# EasyEDA Pro project Dispenser Motor Controller.eprj, board PCB1
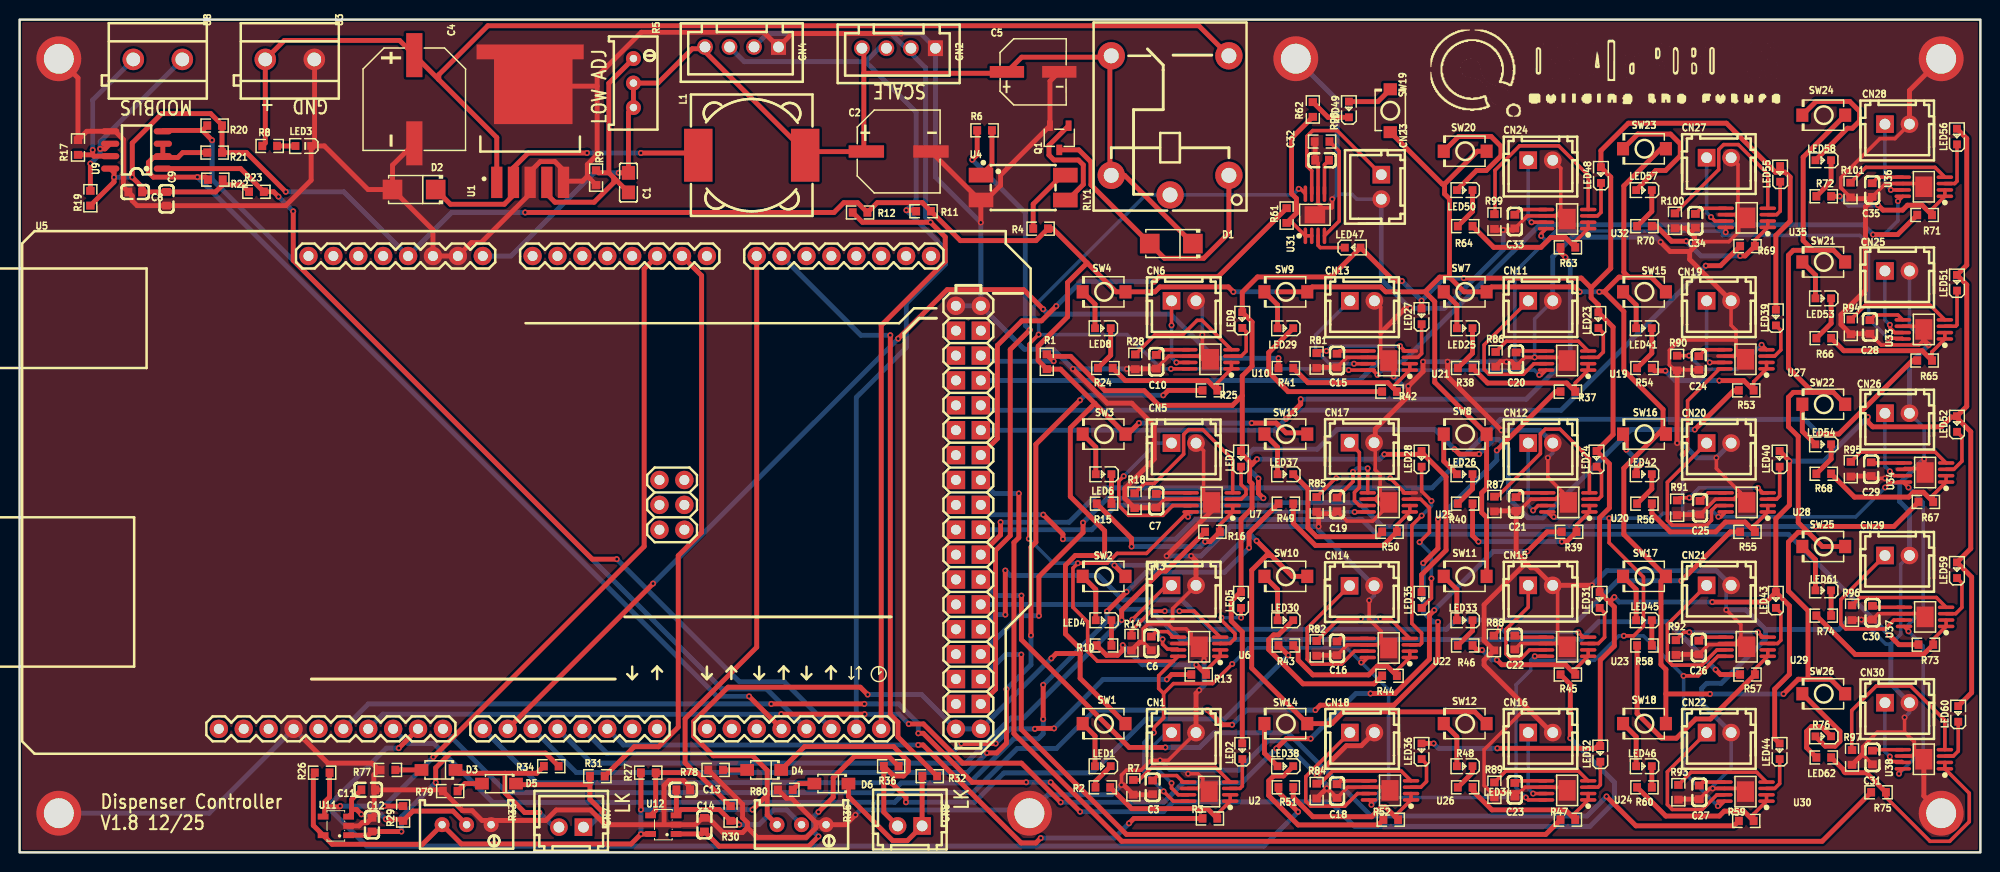
[diagram p3: board, top side]
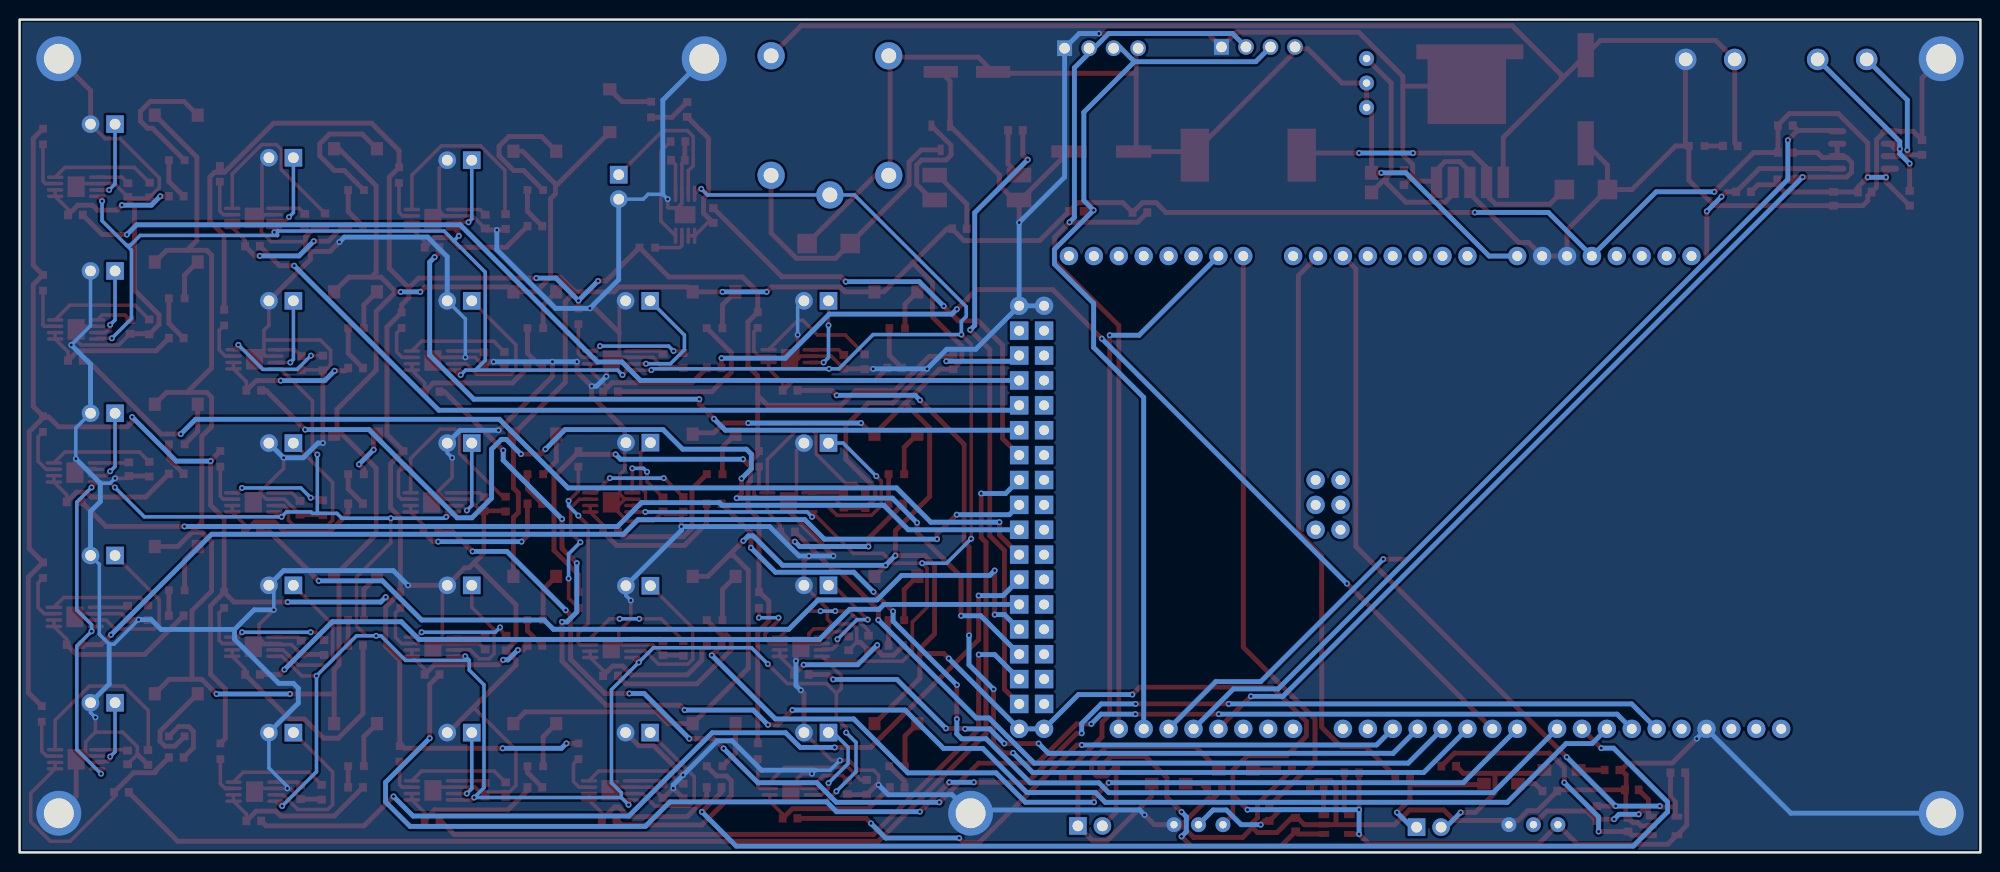
[diagram p4: board, bottom side, seen from below]

Outline 200 x 85 mm; copper layers: Top Layer, Bottom Layer. Coordinates in mm from the lower left corner of the outline.
Outline path: rectangle 0,85 200,0
Stack: Top Layer 0.035mm / Dielectric1 1.51mm FR4 er 4.5 / Bottom Layer 0.035mm

## Design rules (mm)
template: Custom Config
spacing copperThickness1oz (default): track to track 0.102, other pairs 0.152 to 0.3
spacing copperThickness2oz: track to track 0.203, other pairs 0.152 to 0.3
track width copperThickness1oz (default): min 0.127, default 0.5, max 2.54
track width copperThickness2oz: min 0.203, default 0.254, max 2.54
differential pair differentialPair (default): width min 0.127, default 0.254, max 2.54; gap min 0.152, default 0.152
via viaSize (default): diameter min 0.6, default 0.61, max 10; hole min 0.3, default 0.305, max 6.3

## Placement (name value [footprint] x y rotation side)
C1  5nF  [C0805]  62.1 68.36 90 top
C2  470uF  [CAP-SMD_BD8.0-L8.3-W8.3-LS9.1-FD]  89.66 71.54 0 top
C3  47uF  [C0603]  115.57 6.64 90 top
C4  220uF  [CAP-SMD_BD10.0-L10.3-W10.3-LS11.3-FD]  40.26 76.87 270 top
C5  220uF  [CAP-SMD_BD6.3-L6.6-W6.6-LS7.4-FD]  103.38 79.67 0 top
C6  47uF  [C0603]  115.43 21.33 90 top
C7  47uF  [C0603]  115.94 35.9 90 top
C8  10uF  [C0603]  11.79 67.4 180 top
C9  1uF  [C0603]  14.99 66.71 270 top
C10  47uF  [C0603]  115.94 50.08 90 top
C11  1uF  [C0603]  35.56 6.39 180 top
C12  1uF  [C0603]  35.94 2.83 270 top
C13  1uF  [C0603]  67.69 6.39 180 top
C14  1uF  [C0603]  69.85 2.83 270 top
C15  47uF  [C0603]  134.38 50.2 90 top
C16  47uF  [C0603]  134.38 20.83 90 top
C18  47uF  [C0603]  134.38 6.26 90 top
C19  47uF  [C0603]  134.38 35.52 90 top
C20  47uF  [C0603]  152.64 50.33 90 top
C21  47uF  [C0603]  152.64 35.56 90 top
C22  47uF  [C0603]  152.51 21.42 90 top
C23  47uF  [C0603]  152.51 6.39 90 top
C24  47uF  [C0603]  171.28 49.95 90 top
C25  47uF  [C0603]  171.4 35.18 90 top
C26  47uF  [C0603]  171.28 20.91 90 top
C27  47uF  [C0603]  171.33 6.13 90 top
C28  47uF  [C0603]  188.74 53.63 90 top
C29  47uF  [C0603]  188.86 39.11 90 top
C30  47uF  [C0603]  188.99 24.47 90 top
C31  47uF  [C0603]  188.99 9.69 90 top
C32  47uF  [C0603]  132.85 70.65 0 top
C33  47uF  [C0603]  152.51 64.39 90 top
C34  47uF  [C0603]  170.93 64.47 90 top
C35  47uF  [C0603]  188.96 67.6 90 top
CN1  ZX-XH2.54-2PZZ  [CONN-TH_2P-P2.50_HX25003-2A]  118.75 12.23 0 top
CN2  ZX-XH2.54-4PZZ  [CONN-TH_4P-P2.50_4PIN]  89.66 82.08 180 top
CN3  ZX-XH2.54-2PZZ  [CONN-TH_2P-P2.50_HX25003-2A]  118.75 27.26 0 top
CN4  ZX-XH2.54-4PZZ  [CONN-TH_4P-P2.50_4PIN]  73.66 82.21 180 top
CN5  ZX-XH2.54-2PZZ  [CONN-TH_2P-P2.50_HX25003-2A]  118.75 41.78 0 top
CN6  ZX-XH2.54-2PZZ  [CONN-TH_2P-P2.50_HX25003-2A]  118.75 56.3 0 top
CN7  ZX-XH2.54-2PZZ  [CONN-TH_2P-P2.50_HX25003-2A]  56.26 2.58 180 top
CN8  ZX-XH2.54-2PZZ  [CONN-TH_2P-P2.50_HX25003-2A]  90.81 2.7 180 top
CN11  ZX-XH2.54-2PZZ  [CONN-TH_2P-P2.50_HX25003-2A]  155.13 56.3 0 top
CN12  ZX-XH2.54-2PZZ  [CONN-TH_2P-P2.50_HX25003-2A]  155.13 41.78 0 top
CN13  ZX-XH2.54-2PZZ  [CONN-TH_2P-P2.50_HX25003-2A]  136.94 56.3 0 top
CN14  ZX-XH2.54-2PZZ  [CONN-TH_2P-P2.50_HX25003-2A]  136.91 27.22 0 top
CN15  ZX-XH2.54-2PZZ  [CONN-TH_2P-P2.50_HX25003-2A]  155.13 27.26 0 top
CN16  ZX-XH2.54-2PZZ  [CONN-TH_2P-P2.50_HX25003-2A]  155.13 12.23 0 top
CN17  ZX-XH2.54-2PZZ  [CONN-TH_2P-P2.50_HX25003-2A]  136.91 41.82 0 top
CN18  ZX-XH2.54-2PZZ  [CONN-TH_2P-P2.50_HX25003-2A]  136.94 12.23 0 top
CN19  ZX-XH2.54-2PZZ  [CONN-TH_2P-P2.50_HX25003-2A]  173.32 56.3 0 top
CN20  ZX-XH2.54-2PZZ  [CONN-TH_2P-P2.50_HX25003-2A]  173.32 41.78 0 top
CN21  ZX-XH2.54-2PZZ  [CONN-TH_2P-P2.50_HX25003-2A]  173.32 27.26 0 top
CN22  ZX-XH2.54-2PZZ  [CONN-TH_2P-P2.50_HX25003-2A]  173.32 12.23 0 top
CN23  ZX-XH2.54-2PZZ  [CONN-TH_2P-P2.50_HX25003-2A]  138.89 67.92 270 top
CN24  ZX-XH2.54-2PZZ  [CONN-TH_2P-P2.50_HX25003-2A]  155.13 70.65 0 top
CN25  ZX-XH2.54-2PZZ  [CONN-TH_2P-P2.50_HX25003-2A]  191.52 59.35 0 top
CN26  ZX-XH2.54-2PZZ  [CONN-TH_2P-P2.50_HX25003-2A]  191.52 44.83 0 top
CN27  ZX-XH2.54-2PZZ  [CONN-TH_2P-P2.50_HX25003-2A]  173.32 70.9 0 top
CN28  ZX-XH2.54-2PZZ  [CONN-TH_2P-P2.50_HX25003-2A]  191.52 74.33 0 top
CN29  ZX-XH2.54-2PZZ  [CONN-TH_2P-P2.50_HX25003-2A]  191.52 30.31 0 top
CN30  ZX-XH2.54-2PZZ  [CONN-TH_2P-P2.50_HX25003-2A]  191.52 15.28 0 top
D1  SS34  [SMA_L4.3-W2.6-LS5.2-RD]  117.47 62.14 180 top
D2  SS34  [SMA_L4.3-W2.6-LS5.2-RD]  40.24 67.66 180 top
D3  SMF5.0A  [SOD-123FL_L2.7-W1.8-LS3.8-RD]  42.73 8.42 180 top
D4  SMF5.0A  [SOD-123FL_L2.7-W1.8-LS3.8-RD]  75.95 8.42 180 top
D5  SMF5.0A  [SOD-123FL_L2.7-W1.8-LS3.8-RD]  48.89 7.02 180 top
D6  SMF5.0A  [SOD-123FL_L2.7-W1.8-LS3.8-RD]  82.8 7.02 180 top
L1  33uH  [IND-SMD_L12.3-W12.3]  74.68 71.16 0 top
LED1  XL-1608SURC-06  [LED0603-RD_RED]  110.49 8.8 180 top
LED2  XL-1608SURC-06  [LED0603-RD_RED]  124.71 10.32 90 top
LED3  XL-1608UGC-04  [LED0603-RD_GREEN]  28.94 72.1 180 top
LED4  XL-1608SURC-06  [LED0603-RD_RED]  110.57 23.7 180 top
LED5  XL-1608SURC-06  [LED0603-RD_RED]  124.59 25.75 90 top
LED6  XL-1608SURC-06  [LED0603-RD_RED]  110.57 38.6 180 top
LED7  XL-1608SURC-06  [LED0603-RD_RED]  124.59 40.17 90 top
LED8  XL-1608SURC-06  [LED0603-RD_RED]  110.49 53.5 180 top
LED9  XL-1608SURC-06  [LED0603-RD_RED]  124.71 54.33 90 top
LED23  XL-1608SURC-06  [LED0603-RD_RED]  161.04 54.32 90 top
LED24  XL-1608SURC-06  [LED0603-RD_RED]  160.85 40.17 90 top
LED25  XL-1608SURC-06  [LED0603-RD_RED]  147.4 53.5 180 top
LED26  XL-1608SURC-06  [LED0603-RD_RED]  147.4 38.6 180 top
LED27  XL-1608SURC-06  [LED0603-RD_RED]  143 54.71 90 top
LED28  XL-1608SURC-06  [LED0603-RD_RED]  143 40.17 90 top
LED29  XL-1608SURC-06  [LED0603-RD_RED]  129.11 53.5 180 top
LED30  XL-1608SURC-06  [LED0603-RD_RED]  129.11 23.7 180 top
LED31  XL-1608SURC-06  [LED0603-RD_RED]  161.16 25.75 90 top
LED32  XL-1608SURC-06  [LED0603-RD_RED]  161.23 10.06 90 top
LED33  XL-1608SURC-06  [LED0603-RD_RED]  147.4 23.7 180 top
LED34  XL-1608SURC-06  [LED0603-RD_RED]  147.4 8.8 180 top
LED35  XL-1608SURC-06  [LED0603-RD_RED]  143 25.75 90 top
LED36  XL-1608SURC-06  [LED0603-RD_RED]  143 10.32 90 top
LED37  XL-1608SURC-06  [LED0603-RD_RED]  129.11 38.6 180 top
LED38  XL-1608SURC-06  [LED0603-RD_RED]  129.11 8.8 180 top
LED39  XL-1608SURC-06  [LED0603-RD_RED]  179.14 54.58 90 top
LED40  XL-1608SURC-06  [LED0603-RD_RED]  179.52 40.17 90 top
LED41  XL-1608SURC-06  [LED0603-RD_RED]  165.69 53.5 180 top
LED42  XL-1608SURC-06  [LED0603-RD_RED]  165.69 38.6 180 top
LED43  XL-1608SURC-06  [LED0603-RD_RED]  179.14 25.75 90 top
LED44  XL-1608SURC-06  [LED0603-RD_RED]  179.52 10.32 90 top
LED45  XL-1608SURC-06  [LED0603-RD_RED]  165.69 23.7 180 top
LED46  XL-1608SURC-06  [LED0603-RD_RED]  165.69 8.8 180 top
LED47  XL-1608SURC-06  [LED0603-RD_RED]  135.97 61.73 0 top
LED48  XL-1608SURC-06  [LED0603-RD_RED]  161.3 69.12 90 top
LED49  XL-1608SURC-06  [LED0603-RD_RED]  135.59 75.83 90 top
LED50  XL-1608SURC-06  [LED0603-RD_RED]  147.4 67.6 180 top
LED51  XL-1608SURC-06  [LED0603-RD_RED]  197.61 58.14 90 top
LED52  XL-1608SURC-06  [LED0603-RD_RED]  197.61 43.72 90 top
LED53  XL-1608SURC-06  [LED0603-RD_RED]  183.97 56.55 180 top
LED54  XL-1608SURC-06  [LED0603-RD_RED]  183.97 41.65 180 top
LED55  XL-1608SURC-06  [LED0603-RD_RED]  179.58 69.25 90 top
LED56  XL-1608SURC-06  [LED0603-RD_RED]  197.61 73.06 90 top
LED57  XL-1608SURC-06  [LED0603-RD_RED]  165.69 67.6 180 top
LED58  XL-1608SURC-06  [LED0603-RD_RED]  183.97 70.65 180 top
LED59  XL-1608SURC-06  [LED0603-RD_RED]  197.61 28.8 90 top
LED60  XL-1608SURC-06  [LED0603-RD_RED]  197.74 14.13 90 top
LED61  XL-1608SURC-06  [LED0603-RD_RED]  183.97 26.75 180 top
LED62  XL-1608SURC-06  [LED0603-RD_RED]  183.97 11.85 180 top
NOREF  -  [Pad_e268864]  103 4 0 top
NOREF#2  -  [Pad_e268862]  196 4 0 top
NOREF#3  -  [Pad_e268861]  196 81 0 top
NOREF#4  -  [Pad_e268863]  130.17 81.01 0 top
NOREF#5  -  [Pad_e268859]  4 4 0 top
NOREF#6  -  [Pad_e268860]  4 81 0 top
Q1  S8050  [SOT-23-3_L2.9-W1.6-P1.90-LS2.8-BR]  106.04 72.94 90 top
R1  10kΩ  [R0603]  104.78 50.08 270 top
R2  1kΩ  [R0603]  110.49 6.64 0 top
R3  4.7kΩ  [R0603]  121.41 3.47 180 top
R4  1kΩ  [R0603]  104.14 63.66 0 top
R5  10kΩ  [RES-ADJ-TH_3P-L10.0-W10.0-P2.50-L]  62.61 78.52 270 top
R6  1kΩ  [R0603]  98.43 73.7 180 top
R7  1kΩ  [R0603]  113.6 6.64 270 top
R8  4.7kΩ  [R0603]  25.51 72.1 0 top
R9  1.15kΩ  [R0603]  58.8 68.87 90 top
R10  1kΩ  [R0603]  110.62 21.12 180 top
R11  4.7kΩ  [R0603]  92.2 65.44 180 top
R12  4.7kΩ  [R0603]  85.72 65.31 180 top
R13  4.7kΩ  [R0603]  120.27 18.16 180 top
R14  1kΩ  [R0603]  113.41 21.37 270 top
R15  1kΩ  [R0603]  110.62 35.6 180 top
R16  4.7kΩ  [R0603]  121.67 32.72 180 top
R17  20kΩ  [R0603]  5.96 71.95 270 top
R18  1kΩ  [R0603]  113.73 35.9 270 top
R19  20kΩ  [R0603]  7.22 66.77 90 top
R20  10kΩ  [R0603]  19.89 74.19 180 top
R21  10kΩ  [R0603]  19.89 71.43 180 top
R22  10kΩ  [R0603]  19.96 68.67 180 top
R23  10kΩ  [R0603]  24.16 67.43 0 top
R24  1kΩ  [R0603]  110.74 49.44 0 top
R25  4.7kΩ  [R0603]  121.41 47.15 180 top
R26  10kΩ  [R0603]  30.86 8.14 180 top
R27  10kΩ  [R0603]  64.13 8.14 180 top
R28  1kΩ  [R0603]  113.8 50.08 270 top
R29  1MΩ  [R0603]  39.12 3.97 90 top
R30  1MΩ  [R0603]  72.52 3.97 90 top
R31  100kΩ  [R0603]  58.93 7.78 180 top
R32  100kΩ  [R0603]  92.84 7.78 180 top
R33  10kΩ  [RES-ADJ-TH_3P-L10.0-W10.0-P2.50-L]  45.59 2.83 180 top
R34  100kΩ  [R0603]  54.23 8.8 0 top
R35  10kΩ  [RES-ADJ-TH_3P-L10.0-W10.0-P2.50-L]  79.76 2.83 180 top
R36  100kΩ  [R0603]  88.9 8.8 0 top
R37  4.7kΩ  [R0603]  157.92 47.03 180 top
R38  1kΩ  [R0603]  147.45 49.44 0 top
R39  4.7kΩ  [R0603]  158.05 32.72 180 top
R40  1kΩ  [R0603]  147.45 35.6 0 top
R41  4.7kΩ  [R0603]  129.16 49.44 180 top
R42  1kΩ  [R0603]  139.73 47.03 0 top
R43  4.7kΩ  [R0603]  129.16 21.12 180 top
R44  1kΩ  [R0603]  139.73 18.03 0 top
R45  4.7kΩ  [R0603]  157.92 18.16 180 top
R46  1kΩ  [R0603]  147.45 21.12 0 top
R47  4.7kΩ  [R0603]  157.92 3.34 180 top
R48  1kΩ  [R0603]  147.45 6.64 0 top
R49  4.7kΩ  [R0603]  129.16 35.6 180 top
R50  1kΩ  [R0603]  139.73 32.72 0 top
R51  4.7kΩ  [R0603]  129.16 6.64 180 top
R52  1kΩ  [R0603]  139.86 3.34 0 top
R53  4.7kΩ  [R0603]  176.12 47.15 180 top
R54  1kΩ  [R0603]  165.74 49.44 0 top
R55  4.7kΩ  [R0603]  176.24 32.72 180 top
R56  1kΩ  [R0603]  165.74 35.6 0 top
R57  4.7kΩ  [R0603]  176.24 18.16 180 top
R58  1kΩ  [R0603]  165.74 21.12 180 top
R59  4.7kΩ  [R0603]  176.12 3.21 180 top
R60  1kΩ  [R0603]  165.74 6.64 180 top
R61  4.7kΩ  [R0603]  129.24 65 90 top
R62  1kΩ  [R0603]  131.91 75.83 270 top
R63  4.7kΩ  [R0603]  157.92 61.76 180 top
R64  1kΩ  [R0603]  147.45 63.92 0 top
R65  4.7kΩ  [R0603]  194.31 50.2 180 top
R66  1kΩ  [R0603]  184.02 52.49 0 top
R67  4.7kΩ  [R0603]  194.44 35.77 180 top
R68  1kΩ  [R0603]  184.02 38.64 0 top
R69  4.7kΩ  [R0603]  176.24 61.88 180 top
R70  1kΩ  [R0603]  165.74 63.92 0 top
R71  4.7kΩ  [R0603]  194.31 65.06 180 top
R72  1kΩ  [R0603]  184.02 66.97 0 top
R73  4.7kΩ  [R0603]  194.44 21.2 180 top
R74  1kΩ  [R0603]  184.02 24.17 180 top
R75  4.7kΩ  [R0603]  189.61 6.13 180 top
R76  1kΩ  [R0603]  184.02 9.69 0 top
R77  1kΩ  [R0603]  37.57 8.42 180 top
R78  1kΩ  [R0603]  70.99 8.42 180 top
R79  1kΩ  [R0603]  43.92 6.26 180 top
R80  1kΩ  [R0603]  78.1 6.39 180 top
R81  1kΩ  [R0603]  132.3 50.2 270 top
R82  1kΩ  [R0603]  132.3 20.83 270 top
R84  1kΩ  [R0603]  132.3 6.26 270 top
R85  1kΩ  [R0603]  132.3 35.52 270 top
R86  1kΩ  [R0603]  150.56 50.33 270 top
R87  1kΩ  [R0603]  150.43 35.56 270 top
R88  1kΩ  [R0603]  150.38 21.37 270 top
R89  1kΩ  [R0603]  150.43 6.39 270 top
R90  1kΩ  [R0603]  169.07 49.95 270 top
R91  1kΩ  [R0603]  169.07 35.18 270 top
R92  1kΩ  [R0603]  168.94 20.91 270 top
R93  1kΩ  [R0603]  169.2 6.14 270 top
R94  1kΩ  [R0603]  186.78 53.63 270 top
R95  1kΩ  [R0603]  186.78 39.11 270 top
R96  1kΩ  [R0603]  186.91 24.47 270 top
R97  1kΩ  [R0603]  186.91 9.69 270 top
R98  1kΩ  [R0603]  132.85 72.55 180 top
R99  1kΩ  [R0603]  150.43 64.39 270 top
R100  1kΩ  [R0603]  168.85 64.47 270 top
R101  1kΩ  [R0603]  186.75 67.6 270 top
RLY1  SRD-05VDC-SL-C  [RELAY-TH_SRD-XXVDC-XL-C]  117.35 74.2 90 top
SW1  TS-1088-AR02016  [SW-SMD_L3.9-W3.0-P4.45]  110.62 13.14 180 top
SW2  TS-1088-AR02016  [SW-SMD_L3.9-W3.0-P4.45]  110.62 28.17 180 top
SW3  TS-1088-AR02016  [SW-SMD_L3.9-W3.0-P4.45]  110.62 42.69 180 top
SW4  TS-1088-AR02016  [SW-SMD_L3.9-W3.0-P4.45]  110.62 57.21 180 top
SW7  TS-1088-AR02016  [SW-SMD_L3.9-W3.0-P4.45]  147.45 57.21 180 top
SW8  TS-1088-AR02016  [SW-SMD_L3.9-W3.0-P4.45]  147.45 42.69 180 top
SW9  TS-1088-AR02016  [SW-SMD_L3.9-W3.0-P4.45]  129.16 57.21 180 top
SW10  TS-1088-AR02016  [SW-SMD_L3.9-W3.0-P4.45]  129.16 28.17 180 top
SW11  TS-1088-AR02016  [SW-SMD_L3.9-W3.0-P4.45]  147.45 28.17 180 top
SW12  TS-1088-AR02016  [SW-SMD_L3.9-W3.0-P4.45]  147.45 13.14 180 top
SW13  TS-1088-AR02016  [SW-SMD_L3.9-W3.0-P4.45]  129.16 42.69 180 top
SW14  TS-1088-AR02016  [SW-SMD_L3.9-W3.0-P4.45]  129.16 13.14 180 top
SW15  TS-1088-AR02016  [SW-SMD_L3.9-W3.0-P4.45]  165.74 57.21 180 top
SW16  TS-1088-AR02016  [SW-SMD_L3.9-W3.0-P4.45]  165.74 42.69 180 top
SW17  TS-1088-AR02016  [SW-SMD_L3.9-W3.0-P4.45]  165.74 28.17 180 top
SW18  TS-1088-AR02016  [SW-SMD_L3.9-W3.0-P4.45]  165.74 13.14 180 top
SW19  TS-1088-AR02016  [SW-SMD_L3.9-W3.0-P4.45]  139.81 75.7 90 top
SW20  TS-1088-AR02016  [SW-SMD_L3.9-W3.0-P4.45]  147.45 71.56 180 top
SW21  TS-1088-AR02016  [SW-SMD_L3.9-W3.0-P4.45]  184.02 60.26 180 top
SW22  TS-1088-AR02016  [SW-SMD_L3.9-W3.0-P4.45]  184.02 45.74 180 top
SW23  TS-1088-AR02016  [SW-SMD_L3.9-W3.0-P4.45]  165.74 71.82 180 top
SW24  TS-1088-AR02016  [SW-SMD_L3.9-W3.0-P4.45]  184.02 75.25 180 top
SW25  TS-1088-AR02016  [SW-SMD_L3.9-W3.0-P4.45]  184.02 31.22 180 top
SW26  TS-1088-AR02016  [SW-SMD_L3.9-W3.0-P4.45]  184.02 16.19 180 top
U1  LM2596SX-ADJ/NOPB  [TO-263-5_L10.2-W8.9-P1.70-TL]  52.07 73.39 90 top
U2  TPS1H200AQDGNRQ1  [EMSOP-8_L3.0-W3.0-P0.65-LS4.9-BL-EP-A]  121.33 6.2 90 top
U3  KF301-5.0-2P  [CONN-TH_P5.00_KF301-5.0-2P]  27.56 80.94 180 top
U4  PC817C  [OPTO-SMD-4_L4.6-W6.5-P2.54-LS10.3-TL]  102.36 67.86 0 top
U5  Arduino Mega 2560  [ARDUINO MEGA 2560 ADDON ON PCB]  5.33 10.07 0 top
U6  TPS1H200AQDGNRQ1  [EMSOP-8_L3.0-W3.0-P0.65-LS4.9-BL-EP-A]  120.32 20.99 90 top
U7  TPS1H200AQDGNRQ1  [EMSOP-8_L3.0-W3.0-P0.65-LS4.9-BL-EP-A]  121.59 35.72 90 top
U8  KF301-5.0-2P  [CONN-TH_P5.00_KF301-5.0-2P]  14.1 80.94 180 top
U9  MAX485ED  [SOP-8_L4.9-W3.9-P1.27-LS6.0-BL]  11.92 71.7 90 top
U10  TPS1H200AQDGNRQ1  [EMSOP-8_L3.0-W3.0-P0.65-LS4.9-BL-EP-A]  121.46 50.33 90 top
U11  LMV331IDBVR  [SOT-23-5_L3.0-W1.7-P0.95-LS2.8-BR]  32.26 2.7 0 top
U12  LMV331IDBVR  [SOT-23-5_L3.0-W1.7-P0.95-LS2.8-BR]  65.66 2.83 0 top
U19  TPS1H200AQDGNRQ1  [EMSOP-8_L3.0-W3.0-P0.65-LS4.9-BL-EP-A]  157.85 50.2 90 top
U20  TPS1H200AQDGNRQ1  [EMSOP-8_L3.0-W3.0-P0.65-LS4.9-BL-EP-A]  157.97 35.72 90 top
U21  TPS1H200AQDGNRQ1  [EMSOP-8_L3.0-W3.0-P0.65-LS4.9-BL-EP-A]  139.65 50.2 90 top
U22  TPS1H200AQDGNRQ1  [EMSOP-8_L3.0-W3.0-P0.65-LS4.9-BL-EP-A]  139.65 20.86 90 top
U23  TPS1H200AQDGNRQ1  [EMSOP-8_L3.0-W3.0-P0.65-LS4.9-BL-EP-A]  157.85 20.99 90 top
U24  TPS1H200AQDGNRQ1  [EMSOP-8_L3.0-W3.0-P0.65-LS4.9-BL-EP-A]  157.85 6.33 90 top
U25  TPS1H200AQDGNRQ1  [EMSOP-8_L3.0-W3.0-P0.65-LS4.9-BL-EP-A]  139.65 35.72 90 top
U26  TPS1H200AQDGNRQ1  [EMSOP-8_L3.0-W3.0-P0.65-LS4.9-BL-EP-A]  139.78 6.33 90 top
U27  TPS1H200AQDGNRQ1  [EMSOP-8_L3.0-W3.0-P0.65-LS4.9-BL-EP-A]  176.04 50.33 90 top
U28  TPS1H200AQDGNRQ1  [EMSOP-8_L3.0-W3.0-P0.65-LS4.9-BL-EP-A]  176.16 35.72 90 top
U29  TPS1H200AQDGNRQ1  [EMSOP-8_L3.0-W3.0-P0.65-LS4.9-BL-EP-A]  176.16 20.99 90 top
U30  TPS1H200AQDGNRQ1  [EMSOP-8_L3.0-W3.0-P0.65-LS4.9-BL-EP-A]  176.04 6.2 90 top
U31  TPS1H200AQDGNRQ1  [EMSOP-8_L3.0-W3.0-P0.65-LS4.9-BL-EP-A]  132.12 65.08 0 top
U32  TPS1H200AQDGNRQ1  [EMSOP-8_L3.0-W3.0-P0.65-LS4.9-BL-EP-A]  157.85 64.64 90 top
U33  TPS1H200AQDGNRQ1  [EMSOP-8_L3.0-W3.0-P0.65-LS4.9-BL-EP-A]  194.23 53.38 90 top
U34  TPS1H200AQDGNRQ1  [EMSOP-8_L3.0-W3.0-P0.65-LS4.9-BL-EP-A]  194.36 38.77 90 top
U35  TPS1H200AQDGNRQ1  [EMSOP-8_L3.0-W3.0-P0.65-LS4.9-BL-EP-A]  176.16 64.77 90 top
U36  TPS1H200AQDGNRQ1  [EMSOP-8_L3.0-W3.0-P0.65-LS4.9-BL-EP-A]  194.23 67.94 90 top
U37  TPS1H200AQDGNRQ1  [EMSOP-8_L3.0-W3.0-P0.65-LS4.9-BL-EP-A]  194.36 24.04 90 top
U38  TPS1H200AQDGNRQ1  [EMSOP-8_L3.0-W3.0-P0.65-LS4.9-BL-EP-A]  194.23 9.51 90 top

## Footprints (pads in the part's own frame, mm; a bottom-side part is the same pattern mirrored in y, then rotated)
ARDUINO MEGA 2560 ADDON ON PCB
  round 1.879 hole 1.016: 0(59.69,2.54) 1(57.15,2.54) 2(54.61,2.54) 3(52.07,2.54) 3.3V(31.75,50.8) 4(49.53,2.54) 5(46.99,2.54) 5V@0(34.29,50.8) 5V@1(90.17,2.54) 5V@2(92.71,2.54) 6(44.45,2.54) 7(41.91,2.54) 8(37.846,2.54) 9(35.306,2.54) 10(32.766,2.54) 11(30.226,2.54) 12(27.686,2.54) 13(25.146,2.54) 14(64.77,2.54) 15(67.31,2.54) 16(69.85,2.54) 17(72.39,2.54) 18(74.93,2.54) 19(77.47,2.54) 20(80.01,2.54) 21(82.55,2.54) A0(46.99,50.8) A1(49.53,50.8) A2(52.07,50.8) A3(54.61,50.8) A4(57.15,50.8) A5(59.69,50.8) A6(62.23,50.8) A7(64.77,50.8) A8(69.85,50.8) A9(72.39,50.8) A10(74.93,50.8) A11(77.47,50.8) A12(80.01,50.8) A13(82.55,50.8) A14(85.09,50.8) A15(87.63,50.8) AREF(20.066,2.54) GND@0(36.83,50.8) GND@1(39.37,50.8) GND@2(22.606,2.54) GND@3(90.17,45.72) GND@4(92.71,45.72) IOREF(26.67,50.8) ISP1_1(59.933,22.86) ISP1_2(62.473,22.86) ISP1_3(59.933,25.4) ISP1_4(62.473,25.4) ISP1_5(59.933,27.94) ISP1_6(62.473,27.94) NC@0(14.986,2.54) NC@1(17.526,2.54) NC@2(24.13,50.8) RESET(29.21,50.8) VIN(41.91,50.8)
  rect 1.879x1.879 hole 1.016: 22(90.17,5.08) 23(92.71,5.08) 24(90.17,7.62) 25(92.71,7.62) 26(90.17,10.16) 27(92.71,10.16) 28(90.17,12.7) 29(92.71,12.7) 30(90.17,15.24) 31(92.71,15.24) 32(90.17,17.78) 33(92.71,17.78) 34(90.17,20.32) 35(92.71,20.32) 36(90.17,22.86) 37(92.71,22.86) 38(90.17,25.4) 39(92.71,25.4) 40(90.17,27.94) 41(92.71,27.94) 42(90.17,30.48) 43(92.71,30.48) 44(90.17,33.02) 45(92.71,33.02) 46(90.17,35.56) 47(92.71,35.56) 48(90.17,38.1) 49(92.71,38.1) 50(90.17,40.64) 51(92.71,40.64) 52(90.17,43.18) 53(92.71,43.18)
C0603
  rect 0.8x0.9 smd: 1(-0.7,0) 2(0.7,0)
C0805
  rect 1.41x1.35 smd: 1(-1,0) 2(1,0)
CAP-SMD_BD6.3-L6.6-W6.6-LS7.4-FD
  rect 3.5x1.2 smd: 1(-2.67,0) 2(2.67,0)
CAP-SMD_BD8.0-L8.3-W8.3-LS9.1-FD
  rect 3.61x1.26 smd: 1(-3.295,0) 2(3.295,0)
CAP-SMD_BD10.0-L10.3-W10.3-LS11.3-FD
  rect 4.5x1.65 smd: 1(-4.5,0) 2(4.5,0)
CONN-TH_2P-P2.50_HX25003-2A
  rect 1.8x1.8 hole 1.1: 1(-1.25,0)
  round 1.8 hole 1.1: 2(1.25,0)
CONN-TH_4P-P2.50_4PIN
  rect 1.524x1.6 hole 1.1: 1(-3.75,0)
  round 1.6 hole 1.1: 2(-1.25,0) 3(1.25,0) 4(3.75,0)
CONN-TH_P5.00_KF301-5.0-2P
  round 2.2 hole 1.4: 1(-2.5,0) 2(2.5,0)
EMSOP-8_L3.0-W3.0-P0.65-LS4.9-BL-EP-A
  oval 0.364x1.692 smd: 1(-0.975,-2.146) 2(-0.325,-2.146) 3(0.325,-2.146) 4(0.975,-2.146) 5(0.975,2.146) 6(0.325,2.146) 7(-0.325,2.146) 8(-0.975,2.146)
  rect 2.1x1.75 smd: 9(0,0)
IND-SMD_L12.3-W12.3
  rect 2.9x5.4 smd: 1(-5.45,0) 2(5.45,0)
LED0603-RD_GREEN
  rect 0.8x0.8 smd: 1(-0.799,-0.004) 2(0.799,0.004)
LED0603-RD_RED
  rect 0.8x0.8 smd: 1(-0.799,-0.004) 2(0.799,0.004)
OPTO-SMD-4_L4.6-W6.5-P2.54-LS10.3-TL
  rect 2.5x1.5 smd: 1(-4.3,1.27) 2(-4.3,-1.27) 3(4.3,-1.27) 4(4.3,1.27)
Pad_e268859
  round 4.572 hole 3.048: 1(0,0)
Pad_e268860
  round 4.572 hole 3.048: 1(0,0)
Pad_e268861
  round 4.572 hole 3.048: 1(0,0)
Pad_e268862
  round 4.572 hole 3.048: 1(0,0)
Pad_e268863
  round 4.572 hole 3.048: 1(0,0)
Pad_e268864
  round 4.572 hole 3.048: 1(0,0)
R0603
  rect 0.806x0.864 smd: 1(-0.753,0) 2(0.753,0)
RELAY-TH_SRD-XXVDC-XL-C
  round 2.794 hole 1.524: 1(-5.1,-6) 2(7.1,-6) 3(7.1,6) 4(-5.1,6) 5(-7.1,0)
RES-ADJ-TH_3P-L10.0-W10.0-P2.50-L
  round 1.524 hole 0.762: 1(-2.5,0) 2(0,0) 3(2.5,0)
SMA_L4.3-W2.6-LS5.2-RD
  rect 2x2 smd: 1(-2.2,0) 2(2.2,0)
SOD-123FL_L2.7-W1.8-LS3.8-RD
  rect 1.4x1.2 smd: 1(-1.735,0) 2(1.735,0)
SOP-8_L4.9-W3.9-P1.27-LS6.0-BL
  oval 0.63x1.865 smd: 1(-1.905,-2.683) 2(-0.635,-2.683) 3(0.635,-2.683) 4(1.905,-2.683) 5(1.905,2.683) 6(0.635,2.683) 7(-0.635,2.683) 8(-1.905,2.683)
SOT-23-3_L2.9-W1.6-P1.90-LS2.8-BR
  rect 1.07x0.6 smd: 1(1.235,-0.95) 2(1.235,0.95) 3(-1.235,0)
SOT-23-5_L3.0-W1.7-P0.95-LS2.8-BR
  rect 1.1x0.6 smd: 1(1.3,-0.95) 2(1.3,0) 3(1.3,0.95) 4(-1.3,0.95) 5(-1.3,-0.95)
SW-SMD_L3.9-W3.0-P4.45
  rect 1.23x1.36 smd: 1(-2.185,0) 2(2.185,0)
TO-263-5_L10.2-W8.9-P1.70-TL
  rect 3.2x1.15 smd: 1(-5.008,3.404) 2(-5.008,1.702) 3(-5.008,0) 4(-5.008,-1.702) 5(-5.008,-3.404)
  custom 8.128x10.922 smd: 6(5.008,-0.318)

## Nets
As in the schematic, except:
GND: C2.2 C3.1 C4.2 C5.2 C6.1 C7.1 C8.2 C9.2 C10.1 C11.1 C12.1 C13.1 C14.1 C15.1 C16.1 C18.1 C19.1 C20.1 C21.1 C22.1 C23.1 C24.1 C25.1 C26.1 C27.1 C28.1 C29.1 C30.1 C31.1 C32.1 C33.1 C34.1 C35.1 CN1.2 CN2.1 CN3.2 CN4.1 CN5.2 CN6.2 CN11.2 CN12.2 CN13.2 CN14.2 CN15.2 CN16.2 CN17.2 CN18.2 CN19.2 CN20.2 CN21.2 CN22.2 CN23.2 CN24.2 CN25.2 CN26.2 CN27.2 CN28.2 CN29.2 CN30.2 D2.2 LED3.1 NOREF.1 NOREF#2.1 NOREF#3.1 NOREF#4.1 NOREF#5.1 NOREF#6.1 Q1.2 R7.2 R9.1 R14.2 R17.1 R18.2 R28.2 R33.1 R35.1 R77.2 R78.2 R79.2 R80.2 R81.2 R82.2 R84.2 R85.2 R86.2 R87.2 R88.2 R89.2 R90.2 R91.2 R92.2 R93.2 R94.2 R95.2 R96.2 R97.2 R98.2 R99.2 R100.2 R101.2 U1.3 U1.5 U1.6 U2.6 U2.9 U3.1 U4.2 U5.GND@0 U5.GND@1 U5.GND@2 U5.GND@3 U5.GND@4 U6.6 U6.9 U7.6 U7.9 U9.5 U10.6 U10.9 U11.2 U12.2 U19.6 U19.9 U20.6 U20.9 U21.6 U21.9 U22.6 U22.9 U23.6 U23.9 U24.6 U24.9 U25.6 U25.9 U26.6 U26.9 U27.6 U27.9 U28.6 U28.9 U29.6 U29.9 U30.6 U30.9 U31.6 U31.9 U32.6 U32.9 U33.6 U33.9 U34.6 U34.9 U35.6 U35.9 U36.6 U36.9 U37.6 U37.9 U38.6 U38.9

Pads without a net: U5 0 1 3.3V 13 14 15 16 22 24 26 28 30 32 34 36 38 40 42 44 46 48 50 52 53 A0 A1 A2 A3 A4 A7 A10 A11 A12 A13 A14 A15 AREF IOREF ISP1_1 ISP1_2 ISP1_3 ISP1_4 ISP1_5 ISP1_6 NC@0 NC@1 NC@2 RESET

## Via types
v1: diameter 0.61, hole 0.305, Top Layer to Bottom Layer, 269 vias

## Routing (per net, layer and track width the routed paths; a pad name or vN(x,y) marks a point on that pad's centre or on a via; arc(x,y) is an arc through that point)
5V: length 697.5
  Top Layer w0.5: SW23.1 167.42,71.82 163.63,68.03 163.63,59.21 164.13,58.71 ; v1(159.13,57.21) 158.63,57.71 150.13,57.71 SW7.1 147.34,57.21 145.84,58.71 ; 127.67,30.3 127.17,30.3 125.67,28.8 125.67,18.81 SW14.1 133.84,13.14 135.04,14.34 148.44,14.34 SW12.1 ; 127.67,30.3 129.8,28.17 SW10.1 ; 127.67,30.3 v1(126.17,31.8) ; v1(161.13,57.21) 161.63,57.21 ; 161.63,57.21 163.63,55.21 163.63,49.21 167.63,45.21 167.63,43.21 ; 161.63,57.21 163.13,58.71 164.13,58.71 ; 182.42,32.67 181.42,33.67 181.42,42.45 180.42,43.45 180.42,46.45 180.92,46.95 182.92,46.95 ; 182.42,32.67 181.42,32.67 180.42,31.67 180.42,26.67 182.42,24.67 182.42,17.67 ; 182.42,32.67 183.87,31.22 SW25.1 ; SW22.1 185,46.95 182.92,46.95 ; 182.92,46.95 180.42,49.45 180.42,60.95 180.92,61.45 182.92,61.45 ; SW19.1 145.11,68.21 145.34,68.21 ; 108.89,60.16 106.89,58.16 106.89,54.66 103.89,51.66 103.89,50.2 R1.2 106.17,49.32 109.67,45.82 ; 108.89,60.16 111.84,57.21 SW4.1 115.8,57.21 116.3,57.71 123.3,57.71 v1(123.8,57.21) ; 108.89,60.16 105.39,63.66 R4.2 103.67,62.44 95.96,62.44 R11.1 92.08,66.31 87.48,66.31 R12.1 85.48,66.31 84.07,66.31 83.07,65.31 v1(51.57,65.31) ; 76.26,5.86 v1(74.76,4.36) ; 76.26,5.86 76.26,8.36 74.76,9.86 70.76,9.86 68.76,11.86 68.76,13.36 72.26,16.86 85.75,16.86 v1(86.5,16.11) ; 76.26,5.86 76.26,3.83 R35.3 ; SW16.1 167.63,42.98 167.63,43.21 ; 145.84,58.71 145.84,66.71 145.34,67.21 145.34,68.21 ; 145.84,58.71 144.84,58.71 143.34,57.21 ; 167.92,16.17 167.92,18.67 167.42,19.17 167.42,27.67 SW17.1 163.63,32.46 163.63,39.21 167.63,43.21 ; 167.92,16.17 SW18.1 ; 167.92,16.17 v1(172.42,16.17) ; R19.1 9.63,68.43 v1(9.63,68.9) 9.63,69.4 U9.8 ; v1(63.37,4.36) R27.2 ; 145.34,68.21 148.69,71.56 SW20.1 ; SW24.1 181.92,70.96 181.92,62.45 182.92,61.45 ; R23.1 22.69,68.14 20.72,68.14 ; v1(179.92,16.17) 181.42,17.67 182.42,17.67 ; 143.34,57.21 139.34,57.21 138.84,57.71 131.84,57.71 SW9.1 v1(128.3,57.21) ; 143.34,57.21 144.34,56.21 144.34,47.98 SW8.1 149.63,37.19 149.13,36.69 149.13,34.69 149.63,34.19 SW11.1 ; 182.42,17.67 184.73,17.67 SW26.1 ; 182.92,61.45 185.02,61.45 SW21.1 ; SW13.1 131.22,42.82 129.17,42.82 128.17,43.82 v1(125.67,43.82) ; R26.2 29.96,7.99 29.96,2.75 U11.5 31.88,0.83 41.09,0.83 R33.3 45.06,0.86 62.37,0.86 v1(63.37,1.86) 64.34,1.86 U12.5 ; 109.67,45.82 107.17,43.32 107.17,36.32 110.67,32.82 v1(110.67,30.3) 107.67,30.3 106.67,29.3 106.67,22.3 108.17,20.8 108.17,20.3 ; 109.67,45.82 112.67,42.82 ; 108.17,20.3 108.17,17.77 SW1.1 ; 108.17,20.3 105.74,20.3 v1(105.24,19.8) ; SW15.1 166.42,58.71 164.13,58.71 ; 112.67,42.82 SW3.1 ; 112.67,42.82 113.17,42.82 v1(114.17,43.82) ; 20.72,68.14 19.99,67.41 C9.1 12.5,67.41 C8.1 12.49,67.9 v1(11.49,68.9) 11.49,72.4 14.49,75.4 19.49,75.4 20.64,74.25 R21.1 23.14,71.43 v1(27.14,67.43) ; 20.72,68.14 R22.1 ; v1(111.67,29.3) SW2.1
  Bottom Layer w0.5: v1(123.8,57.21) v1(128.3,57.21) ; v1(110.67,30.3) v1(111.67,29.3) 122.17,29.3 125.17,32.3 125.67,32.3 v1(126.17,31.8) ; v1(63.37,1.86) v1(63.37,4.36) v1(74.76,4.36) ; v1(27.14,67.43) 33.07,67.43 U5.5V@0 44.07,65.31 v1(51.57,65.31) ; v1(159.13,57.21) v1(161.13,57.21) ; v1(11.49,68.9) v1(9.63,68.9) ; v1(86.5,16.11) 92,16.11 U5.5V@1 U5.5V@2 v1(105.24,19.8) ; v1(172.42,16.17) v1(179.92,16.17) ; v1(114.17,43.82) v1(125.67,43.82)
24V: length 126.5
  Top Layer w0.5: U1.1 48.67,72.96 42.76,78.87 ; 42.76,78.87 42.76,79.37 47.76,84.37 120.28,84.37 RLY1.2 ; 42.76,78.87 C4.1 38.76,82.87 27,82.87 U3.2 25.06,72.41 R8.1
GND: length 1130
  Top Layer w0.364: 175.28,64.83 176.1,64.83 U35.9 ; 175.28,64.83 175.02,65.09 U35.6 ; 175.28,64.83 175.28,70.2 174.57,70.9 ; 175.28,64.83 175.28,63.83 175.35,63.76 175.35,63.33 174.35,62.33 170.85,62.33 ; 120.76,36.05 120.76,41.01 CN5.2 ; 120.76,36.05 121.26,36.05 U7.9 ; 120.76,36.05 U7.6 116.79,36.05 C7.1 ; 138.88,21.57 138.51,21.19 U22.6 135.44,21.19 C16.1 ; 138.88,21.57 138.88,22.57 137.66,23.79 v1(137.66,25.72) ; 138.88,21.57 138.95,21.57 U22.9 ; 139.01,35.32 138.27,36.05 ; 139.01,35.32 139.24,35.32 U25.9 ; 139.01,35.32 139.01,34.82 138.01,33.82 135.38,33.82 C19.1 ; 138.27,36.05 U25.6 ; 138.27,36.05 138.77,36.55 138.77,38.55 138.27,39.05 138.27,41.7 CN17.2 ; U38.6 193.09,9.83 193.27,10.01 ; 175.95,21.21 172.28,21.21 C26.1 ; 175.95,21.21 U29.9 ; 175.95,21.21 175.57,21.58 175.57,21.87 ; C33.1 153.79,64.96 U32.6 156.7,64.96 ; U30.9 175.71,6.53 U30.6 v1(172.69,6.53) 172.43,6.53 171.33,5.43 ; C18.1 135.47,6.66 U26.6 139.45,6.66 U26.9 ; C10.1 117.21,50.65 U10.6 120.31,50.65 120.64,50.33 ; C31.1 187.99,9.99 187.99,10.78 189.49,12.28 192.27,12.28 ; CN24.2 157.2,69.83 157.2,65.46 156.7,64.96 ; 117.11,23.32 117.61,23.82 117.61,24.88 CN3.2 ; 117.11,23.32 115.11,23.32 114.61,22.82 114.61,21.45 C6.1 ; 117.11,23.32 117.61,22.82 118.99,22.82 119.49,22.32 119.49,21.32 ; 156.7,64.96 157.52,64.96 U32.9 ; 152.55,6.16 153.05,6.16 153.55,6.66 U24.6 157.52,6.66 U24.9 ; 152.55,6.16 150.05,6.16 149.38,6.83 149.38,10.48 153.52,14.62 153.88,14.62 ; 152.55,6.16 C23.1 ; U33.9 193.91,53.7 U33.6 ; 194.27,39.18 192.29,39.18 192.21,39.1 ; U38.9 193.72,10.01 193.27,10.01 ; U29.6 175.02,21.32 175.57,21.87 ; 157.38,36.78 155.88,38.28 v1(155.88,40.28) ; 157.38,36.78 157.38,36.32 U20.9 ; 157.38,36.78 156.65,36.05 U20.6 154.15,36.05 153.15,35.05 152.83,35.05 C21.1 ; 156.88,21.32 157.52,21.32 U23.9 ; 156.88,21.32 U23.6 153.11,21.32 C22.1 ; 156.88,21.32 156.88,26.76 CN15.2 ; R101.2 185.75,67.85 185.75,68.85 189.75,72.85 191.28,72.85 CN28.2 ; v1(119.19,8.03) 120.19,8.03 120.69,7.53 120.69,7.03 ; C32.1 132.45,70.35 U31.6 132.45,66.23 132.89,65.78 ; 194.23,52.29 193.73,51.79 189.88,51.79 C28.1 ; v1(173.07,40.28) 173.07,39.18 175.52,36.73 ; CN13.2 138.83,55.66 138.83,50.53 ; 175.52,36.73 175.52,36.37 U28.9 ; 175.52,36.73 174.84,36.05 U28.6 172.98,36.05 C25.1 ; U37.9 194.03,24.36 189.59,24.36 C30.1 ; 138.83,50.53 139.33,50.53 U21.9 ; 138.83,50.53 U21.6 135.4,50.53 C15.1 ; v1(133.89,66.67) 133.89,65.83 133.84,65.78 132.89,65.78 ; 175.57,21.87 175.57,23.26 v1(174.07,24.76) ; 120.69,7.03 120.69,6.85 U2.9 ; 120.69,7.03 120.19,6.53 U2.6 ; 175.07,52.3 175.07,50.8 ; 175.07,52.3 175.07,53.3 174.57,53.8 174.57,56.3 ; 175.07,52.3 169.32,52.3 168.28,51.25 168.28,49.75 168.78,49.25 169.12,49.25 ; 175.07,50.8 174.93,50.65 U27.6 ; 175.07,50.8 175.57,50.8 U27.9 ; 119.49,21.32 119.99,21.32 U6.9 ; 119.49,21.32 U6.6 ; CN1.2 117.16,9.39 v1(116.33,9.39) 115.39,9.39 114.39,8.39 112.89,8.39 112.39,7.89 v1(112.39,6.89) ; U19.9 157.52,50.53 U19.6 v1(154.53,50.53) 153.53,50.53 C20.1 ; C29.1 189.1,38.18 v1(190.27,38.18) ; 169.28,49.25 C24.1 ; 120.64,50.33 v1(120.64,52.83) ; 120.64,50.33 U10.9 ; C35.1 190.32,68.27 U36.6 193.91,68.27 U36.9 ; 192.27,12.28 193.27,11.28 193.27,10.01 ; 192.27,12.28 v1(192.27,13.78) ; U31.9 132.82,65.78 132.89,65.78
  Top Layer w0.5: 150.43,5.64 150.55,5.76 150.55,6.16 ; v1(167.38,62.3) 168.35,61.33 170.35,61.33 ; 74.24,2.53 74.24,3.03 73.74,3.53 73.74,4.92 R78.2 ; 74.24,2.53 75.24,1.53 80.24,1.53 81.24,2.53 81.24,3.03 ; 74.24,2.53 73.74,2.03 71.74,2.03 70.24,3.53 69.66,3.53 68.96,2.83 U12.2 65.74,2.83 ; 36.63,8.42 36.13,7.92 36.13,6.42 36.16,6.39 ; 36.63,8.42 35.94,9.11 31.44,9.11 v1(28.94,11.61) ; 36.63,8.42 R77.2 ; C29.1 186.83,38.41 R95.2 ; 174.57,56.3 170.35,60.53 170.35,61.33 ; CN3.2 120,29.76 v1(119.5,30.26) ; 170.35,61.33 170.85,61.83 170.85,62.83 170.35,63.33 ; C21.1 150.48,34.86 R87.2 ; v1(112.39,6.89) 112.6,6.89 R7.2 115.52,5.89 C3.1 ; D2.2 42.16,63.53 U5.GND@0 U5.GND@1 46.07,62.24 47.07,62.24 52.07,67.24 U1.3 52.1,68.41 52.1,69.51 53.1,70.51 54.6,70.51 55.6,69.51 55.6,68.51 ; D2.2 38.04,70.15 C4.2 ; D2.2 35.54,67.66 31.09,72.11 30.09,72.11 ; 47.66,3.26 R33.1 ; 47.66,3.26 53.67,3.26 54.74,4.33 58.24,4.33 59.74,2.83 65.74,2.83 ; 47.66,3.26 47.17,3.26 46.17,4.26 45.17,4.26 R79.2 43.04,6.39 C11.1 36.16,6.39 ; v1(120.82,19.55) 120.82,20.49 U6.9 ; C13.1 68.24,6.54 68.24,6.83 67.74,7.33 66.24,7.33 65.74,6.83 65.74,2.83 ; C5.2 105.09,78.71 Q1.2 100.06,69.14 100.06,68.08 98.56,66.58 98.06,66.58 ; v1(169.07,41.78) R90.2 169.12,49.25 169.28,49.25 ; v1(89.91,83.58) 78.78,83.58 CN4.1 75.91,83.71 63.41,83.71 58.91,79.21 58.91,78.21 ; R97.2 187.96,9.99 187.99,9.99 ; v1(112.94,49.35) 113.94,49.35 ; 113.94,49.35 R28.2 ; 113.94,49.35 115.91,49.35 C10.1 ; R82.2 132.35,20.13 C16.1 ; v1(120.32,16.55) 120,16.23 CN1.2 ; CN16.2 156.27,12.23 153.88,14.62 149.38,19.12 149.38,19.62 R88.2 149.38,21.62 149.38,25.27 153.65,29.55 ; v1(194.73,51.79) 194.23,52.29 U33.9 ; 153.65,29.55 154.15,29.05 154.59,29.05 CN15.2 v1(160.38,27.26) ; 153.65,29.55 152.65,30.55 152.65,34.55 153.15,35.05 ; 81.24,3.03 78.74,5.53 78.21,5.53 R80.2 ; 81.24,3.03 82.06,3.03 R35.1 84.26,2.83 v1(85.26,3.83) ; v1(143.15,50.08) 143.15,49.08 v1(141.65,47.58) 141.65,46.58 138.27,43.2 138.27,41.7 ; 98.06,66.58 97.91,66.58 C2.2 ; 98.06,66.58 98.04,66.57 v1(98.04,64.29) ; 170.35,63.33 170.49,63.33 C34.1 ; 170.35,63.33 169.96,63.72 R100.2 ; R86.2 151.06,50.08 v1(151.65,50.08) 152.19,50.08 C20.1 ; C28.1 186.83,52.93 R94.2 185.78,53.88 185.78,54.88 188.28,57.38 188.28,65.88 188.78,66.38 188.78,66.72 ; C18.1 134.3,5.56 v1(133.33,6.54) R84.2 ; C32.1 132.15,72.5 R98.2 ; 36.16,6.39 36.16,3.75 35.44,3.03 34.94,3.03 34.61,2.7 U11.2 ; 132.5,34.56 134.12,34.56 C19.1 ; 132.5,34.56 v1(132.5,33.26) ; 132.5,34.56 R85.2 ; R96.2 186.95,23.76 v1(187.86,23.76) 188.98,23.76 C30.1 ; R81.2 132.35,49.5 C15.1 ; R101.2 186.88,66.72 188.78,66.72 ; 188.78,66.72 C35.1 ; 58.91,78.21 58.91,71.21 57.91,70.21 57.91,69.01 ; 58.91,78.21 52.59,78.21 52.39,78.4 ; C33.1 152.35,63.53 v1(151.33,63.53) 150.54,63.53 R99.2 ; 114.61,21.45 114.24,21.45 R14.2 ; 55.6,68.51 57.41,68.51 57.91,69.01 ; 55.6,68.51 55.48,68.39 ; 30.09,72.11 LED3.1 29.73,68.61 27.14,66.01 C9.2 11.99,66.01 11.49,66.51 11.49,67.01 C8.2 10.59,67.9 10.59,72.75 9.74,73.6 U9.5 6.85,73.6 R17.1 5.96,79.04 NOREF#6.1 ; 30.09,72.11 30.09,80.91 U3.1 ; CN28.2 192.77,77.77 NOREF#3.1 ; R91.2 169.12,34.48 C25.1 ; 57.91,69.01 R9.1 ; v1(141.83,55.53) 141.33,55.53 138.83,53.03 ; R93.2 169.25,5.43 171.33,5.43 ; C7.1 113.78,35.2 R18.2 112.73,36.14 112.73,37.14 115.73,40.14 115.73,43.56 113.44,45.85 110.94,45.85 v1(107.44,49.35) ; U21.9 140.15,49.7 v1(140.15,48.58) ; v1(145.65,50.08) 145.65,48.58 v1(151.15,43.08) ; U34.9 194.27,38.86 v1(194.27,40.18) ; CN18.2 136.85,10.89 135.33,10.89 v1(132.33,7.89) ; R92.2 169,20.21 C26.1 ; v1(117,30.26) 121.59,34.85 U7.9 ; U38.9 194.23,5.77 NOREF#2.1
  Bottom Layer w0.364: v1(194.73,51.79) 192.77,53.76 CN25.2 ; CN29.2 191.86,29.4 191.86,22.26 190.86,21.26 190.36,21.26 v1(187.86,23.76) ; CN23.2 136.39,66.67 135.89,67.17 134.39,67.17 v1(133.89,66.67) ; CN6.2 120.64,55.65 v1(120.64,52.83) ; 191.77,37.68 190.77,37.68 v1(190.27,38.18) ; CN30.2 192.77,14.28 v1(192.27,13.78) ; CN12.2 156.38,40.78 v1(155.88,40.28) ; CN11.2 154.53,54.45 v1(154.53,50.53) ; v1(116.33,9.39) 117.33,8.39 118.83,8.39 v1(119.19,8.03) ; 174.57,27.26 174.07,26.76 v1(174.07,24.76) ; CN26.2 194.27,43.33 v1(194.27,40.18) ; CN14.2 138.16,26.22 v1(137.66,25.72) ; 174.57,12.23 174.57,8.61 172.69,6.73 v1(172.69,6.53)
  Bottom Layer w0.5: v1(117,30.26) v1(119.5,30.26) 120.5,30.26 123.5,33.26 v1(132.5,33.26) 132.5,32.88 CN14.2 ; v1(151.15,43.08) 155.08,43.08 CN12.2 ; NOREF#4.1 134.39,76.79 134.39,67.17 ; v1(174.07,24.76) 176.07,24.76 178.07,22.76 ; CN29.2 192.77,34.81 191.77,35.81 191.77,37.68 v1(194.27,40.18) ; v1(160.38,27.26) 161.88,28.76 173.07,28.76 174.57,27.26 ; 190.86,21.26 190.86,17.18 CN30.2 ; U5.GND@4 U5.GND@3 ; U5.GND@4 102.48,51.35 105.44,51.35 v1(107.44,49.35) v1(112.94,49.35) ; U5.GND@4 v1(98.04,64.29) 93.41,68.92 CN2.1 91.91,83.58 v1(89.91,83.58) ; v1(143.15,50.08) v1(145.65,50.08) v1(151.65,50.08) ; v1(194.73,51.79) 192.77,49.83 CN26.2 ; v1(28.94,11.61) U5.GND@2 19.33,4 NOREF#5.1 ; 174.57,41.78 173.08,40.28 171.07,40.28 169.57,41.78 v1(169.07,41.78) ; 178.07,22.76 178.07,21.76 173.57,17.26 172.07,17.26 171.57,16.76 171.57,15.23 174.57,12.23 ; 178.07,22.76 185.57,22.76 186.57,23.76 v1(187.86,23.76) ; v1(85.26,3.83) 85.76,4.33 102.67,4.33 NOREF.1 104.89,5.89 111.39,5.89 v1(112.39,6.89) ; CN11.2 156.38,60.8 158.38,62.8 166.88,62.8 v1(167.38,62.3) ; 118.83,8.39 124.33,8.39 127.33,11.39 128.83,11.39 v1(132.33,7.89) 133.33,6.89 v1(133.33,6.54) ; v1(141.65,47.58) 141.15,47.58 v1(140.15,48.58) ; v1(151.33,63.53) 151.33,61.53 145.33,55.53 v1(141.83,55.53) 138.89,58.46 CN23.2 ; v1(120.32,16.55) 120.82,17.05 v1(120.82,19.55)
FAULTBUS: length 411.3
  Top Layer w0.5: LED56.2 198.61,72.86 198.61,59.94 LED51.2 198.61,57.94 198.61,45.52 LED52.2 197.52,44.44 ; 104.97,50.63 v1(105.47,50.13) ; 104.97,50.63 R1.1 ; 104.97,50.63 107.21,50.63 110.71,47.13 114.71,47.13 116.21,45.63 123.71,45.63 124.71,46.63 ; 197.52,44.44 199.02,42.94 199.02,31.01 LED59.2 199.11,28.1 199.11,16.31 LED60.2 ; 197.52,44.44 197.02,44.44 196.02,43.44 189.02,43.44 188.52,43.94 v1(188.52,44.44) ; v1(172.66,25.55) 178.14,25.55 LED43.2 ; LED55.2 179.6,70.03 179.6,69.42 ; 162.16,25.55 v1(162.66,26.05) ; 162.16,25.55 162.66,25.05 162.66,21.05 161.23,19.62 161.23,11.12 ; 162.16,25.55 LED31.2 161.16,34.16 162.16,35.16 162.16,39.66 LED24.2 162.53,42.65 162.53,53.62 LED23.2 161.03,55.88 160.3,56.62 160.3,57.62 ; LED43.2 180.52,25.17 180.52,18.17 179.02,16.67 179.02,11.62 LED44.2 ; LED43.2 179.14,34.05 180.52,35.44 180.52,39.97 LED40.2 ; 124.58,26.63 123.58,25.63 123.58,23.63 124.71,22.5 LED2.2 ; 124.58,26.63 124.58,34 125.71,35.13 125.71,37.63 125.46,37.88 125.46,39.38 125.71,39.63 ; 124.58,26.63 LED5.2 ; 124.71,46.63 124.71,41.1 ; 124.71,46.63 124.71,48.63 125.71,49.63 125.71,54.13 LED9.2 124.71,57.17 126.27,58.73 133.77,58.73 LED47.2 140.19,58.32 v1(141,58.32) ; 124.71,41.1 LED7.2 ; 124.71,41.1 124.71,40.63 125.71,39.63 ; 142.71,40.63 LED28.2 ; 142.71,40.63 v1(139.21,40.63) ; 142.71,40.63 143.21,40.63 145.5,38.34 145.5,30.84 143,28.34 LED35.2 ; 125.71,39.63 v1(126.21,40.13) ; 179.6,69.42 179.1,69.42 174.1,74.42 164.1,74.42 161.3,71.62 LED48.2 162.3,68.92 162.3,59.62 160.3,57.62 ; 179.6,69.42 180.1,69.42 180.6,68.92 180.6,64.42 179.14,62.97 LED39.2 ; 160.3,57.62 159.3,58.62 v1(147.3,58.62) ; v1(144.23,11.12) LED36.2 ; v1(143,56.32) LED27.2 ; 161.23,11.12 LED32.2 ; 161.23,11.12 160.73,10.62 v1(150.73,10.62)
  Bottom Layer w0.5: v1(139.21,40.63) 138.71,40.13 v1(126.21,40.13) ; v1(162.66,26.05) 163.16,25.55 v1(172.66,25.55) ; v1(188.52,44.44) 184.02,39.94 v1(180.52,39.94) ; v1(150.73,10.62) 144.73,10.62 v1(144.23,11.12) ; v1(105.47,50.13) 98.62,50.13 U5.51 ; v1(141,58.32) v1(143,56.32) 145.3,58.62 v1(147.3,58.62)
LEAKSENS1: length 80.5
  Top Layer w0.5: R26.1 31.61,5.64 31.11,5.14 31.11,4.64 ; v1(32.7,4.73) 32.61,4.64 31.11,4.64 ; 31.11,4.64 31.11,3.81 U11.4 ; v1(37.2,4.73) R29.2 ; U5.A5 63.7,59.55 63.7,31.23 v1(42.2,9.73)
  Bottom Layer w0.5: v1(32.7,4.73) v1(37.2,4.73) v1(42.2,9.73)
LEAKSENS1_SUPPPLY: length 59.5
  Top Layer w0.5: U5.A6 69.56,58.87 69.56,32.67 67.18,30.28 67.18,12.78 65.18,10.78 62.68,10.78 R31.1
LEAKSENS2: length 69.8
  Top Layer w0.5: U12.4 64.88,4.3 R27.1 68.88,8.14 ; R30.2 69.1,8.14 68.88,8.14 ; 68.88,8.14 67.88,9.14 67.88,13.64 75.18,20.94 U5.A8
LEAKSENS2_SUPPPLY: length 61.4
  Top Layer w0.5: v1(88.81,52.78) 88.81,14.06 89.59,13.28 89.59,11.78 R32.1
  Bottom Layer w0.5: U5.A9 85.81,52.78 v1(88.81,52.78)
LOW: length 118
  Top Layer w0.5: 119.68,62.14 112.71,69.11 RLY1.4 111.21,69.25 111.21,81.17 ; 111.21,81.17 102.21,81.17 C5.1 100.56,79.52 86.11,79.52 ; 111.21,81.17 RLY1.3 ; 86.11,79.52 86.11,81.88 CN2.4 ; 86.11,79.52 86.11,71.52 ; v1(61.1,69.36) C1.2 62.1,75.52 R5.3 R5.2 65.11,78.52 68.61,82.02 69.61,82.02 ; 86.11,71.52 80.11,71.52 ; 86.11,71.52 C2.1 ; 69.61,82.02 69.73,82.02 CN4.4 ; 69.61,82.02 80.11,71.52 ; 80.11,71.52 L1.2
  Bottom Layer w0.5: 47.25,60.86 50.1,60.86 58.6,69.36 v1(61.1,69.36)
MILK1: length 66.6
  Top Layer w0.5: v1(91.66,10.97) 92.16,10.97 102.16,0.97 103.66,0.97 v1(104.16,1.47) ; R3.2 113.66,3.47 v1(113.16,2.97)
  Bottom Layer w0.5: v1(91.66,10.97) 61.59,10.97 U5.2 ; v1(104.16,1.47) 111.66,1.47 v1(113.16,2.97)
MILK2: length 66.5
  Top Layer w0.5: v1(117.02,17.66) 117.52,18.16 R13.2 ; v1(99.56,11.11) v1(96.06,11.11) ; v1(103.56,12.61) 103.61,12.66 v1(105.52,12.66)
  Bottom Layer w0.5: v1(117.02,17.66) 110.52,17.66 v1(105.52,12.66) ; v1(96.06,11.11) 95.06,10.11 59.9,10.11 U5.3 ; v1(99.56,11.11) 101.06,12.61 v1(103.56,12.61)
MILK3: length 77.9
  Top Layer w0.5: R16.2 116.91,28.72 116.41,28.72 112.41,24.72 v1(112.41,23.72)
  Bottom Layer w0.5: v1(112.41,23.72) 102.41,13.72 101.13,13.72 96.52,9.11 58.36,9.11 U5.4
MILK4: length 102.4
  Top Layer w0.5: v1(108.16,46.15) 103.66,41.65 103.66,31.65 103.16,31.15 v1(103.16,22.15) ; v1(98.66,10.15) 99.66,10.15 100.66,11.15 v1(100.66,16.65) ; v1(116.66,46.65) 117.16,47.15 R25.2
  Bottom Layer w0.5: v1(100.66,16.65) 103.16,19.15 v1(103.16,22.15) ; v1(116.66,46.65) 108.66,46.65 v1(108.16,46.15) ; v1(98.66,10.15) 96.66,8.15 56.78,8.15 U5.5
MILK5: length 101.1
  Top Layer w0.5: v1(64.61,27.44) U5.6 ; v1(104.41,55.44) 102.41,57.44 94.61,57.44 v1(89.61,52.44) ; R41.2 v1(128.41,50.44)
  Bottom Layer w0.5: v1(104.41,55.44) 104.91,54.94 117.41,54.94 121.91,50.44 v1(128.41,50.44) ; v1(89.61,52.44) v1(64.61,27.44)
MILK6: length 93.2
  Top Layer w0.5: R43.2 v1(129.41,20.12) ; v1(90.41,5.12) 90.41,5.62 v1(88.91,7.12)
  Bottom Layer w0.5: U5.7 52.73,7.12 v1(88.91,7.12) ; v1(129.41,20.12) 122.91,13.62 114.91,13.62 109.41,8.12 100.41,8.12 97.41,5.12 v1(90.41,5.12)
MILK7: length 104.5
  Top Layer w0.5: v1(112.91,26.6) v1(110.91,24.6) ; R49.2 125.41,32.6 v1(125.41,31.1) ; v1(104.41,17.1) v1(104.41,13.6)
  Bottom Layer w0.5: v1(112.91,26.6) 114.91,28.6 122.91,28.6 v1(125.41,31.1) ; U5.8 49.69,6.1 88.91,6.1 89.91,7.1 96.91,7.1 101.41,11.6 103.91,11.6 104.41,12.1 v1(104.41,13.6) ; v1(110.91,24.6) 110.91,23.6 v1(104.41,17.1)
MILK8: length 117.6
  Top Layer w0.5: v1(130.41,4.14) 128.41,6.14 R51.2 ; v1(38.67,10.64) U5.9
  Bottom Layer w0.5: v1(38.67,10.64) 37.41,10.64 31.91,5.14 31.91,4.14 35.41,0.64 126.91,0.64 v1(130.41,4.14)
MOTORSUPPLY: length 479.8
  Top Layer w0.364: v1(173.22,4.73) 173.39,4.73 U30.8 ; v1(169.72,18.02) 171.22,18.02 173.22,20.02 174.02,20.02 ; v1(136.85,19.39) 137.01,19.39 U22.8 ; v1(102.94,32.02) 102.94,51.85 v1(103.94,52.85) ; 119.17,34.75 119.44,34.75 ; 119.17,34.75 114.94,30.52 111.94,30.52 110.94,29.52 v1(107.94,29.52) 107.44,29.02 107.44,25.02 108.94,23.52 108.94,20.52 109.94,19.52 117.67,19.52 ; 119.17,34.75 v1(119.17,34.25) ; U33.8 192.02,52.47 v1(190.59,52.47) ; v1(162.13,34.1) 162.13,31.6 165.63,28.1 165.63,23.1 164.63,22.1 v1(163.63,22.1) ; 116.69,16.23 116.69,13.73 115.69,12.73 v1(115.69,12.23) ; 116.69,16.23 116.19,16.73 116.19,18.03 117.67,19.52 ; 116.69,16.23 117.69,17.23 121.69,17.23 v1(123.69,19.23) ; U32.8 155.2,63.16 v1(155.2,62.92) ; 155.83,34.75 156.33,34.25 v1(156.49,34.25) ; v1(117.44,49.35) U10.8 ; v1(137.89,4.86) 137.89,5.1 U26.8 ; 192.16,37.75 v1(192.66,37.25) ; 192.16,37.75 190.78,37.75 v1(190.28,37.25) ; 192.16,37.75 192.21,37.8 ; 131.15,67.23 130.65,67.73 v1(130.47,67.73) ; v1(153.63,5.6) 153.88,5.36 U24.8 ; v1(154.55,20.02) 155.7,20.02 ; U27.8 173.39,49.35 170.13,46.1 170.13,41.1 v1(169.63,40.6) ; v1(191.7,8.03) 191.7,8.14 U38.8 ; v1(173.28,34.25) 173.52,34.25 174.02,34.75 ; v1(135.57,49.23) U21.8 138.01,49.23 v1(138.51,48.73) ; 117.67,19.52 118.17,20.02 ; v1(116.69,6.23) 117.69,5.23 U2.8 ; v1(136.17,34.75) 137.51,34.75 ; v1(191.59,66.47) U36.8 ; v1(174.02,63.29) U35.8 ; v1(192.66,22.56) 192.66,22.61 192.21,23.06 ; v1(155.01,48.73) 155.2,48.73 U19.8
  Bottom Layer w0.364: v1(116.69,6.23) 114.69,8.23 114.69,11.23 v1(115.69,12.23) ; 173.7,63.44 173.67,63.42 156.7,63.42 155.7,62.42 ; 173.7,63.44 173.7,63.47 ; 173.7,63.44 173.7,62.97 ; 153.51,49.23 154.51,49.23 v1(155.01,48.73) ; 153.51,49.23 139.01,49.23 v1(138.51,48.73) ; 153.51,49.23 152.51,50.23 152.51,59.23 155.7,62.42 ; 138.63,5.6 v1(153.63,5.6) 152.63,6.6 152.63,17.1 154.13,18.6 154.13,19.6 ; 138.63,5.6 v1(137.89,4.86) ; 138.63,5.6 138.63,6.1 139.63,7.1 139.63,16.6 v1(136.85,19.39) 135.35,20.89 125.35,20.89 v1(123.69,19.23) ; v1(190.28,37.25) 187.28,34.25 v1(173.28,34.25) 172.78,34.75 170.28,34.75 170.13,34.6 169.63,34.6 ; 173.7,62.97 187.7,62.97 188.7,61.97 189.09,61.97 ; 173.7,62.97 v1(174.02,63.29) ; v1(191.59,66.47) 191.59,64.47 189.09,61.97 ; 155.7,62.42 v1(155.2,62.92) ; v1(130.47,67.73) 129.85,67.11 RLY1.5 114.85,67.11 103.44,55.7 103.44,54.7 103.94,54.2 v1(103.94,52.85) 112.94,52.85 116.44,49.35 v1(117.44,49.35) 135.44,49.35 v1(135.57,49.23) ; 154.13,19.6 v1(154.55,20.02) ; 154.13,19.6 160.63,19.6 163.13,22.1 v1(163.63,22.1) 165.63,22.1 v1(169.72,18.02) 169.72,8.23 v1(173.22,4.73) ; v1(191.7,8.03) 194.16,10.5 194.16,21.06 v1(192.66,22.56) 192.66,23.25 194.16,24.75 194.16,35.75 v1(192.66,37.25) ; v1(107.94,29.52) 105.44,29.52 v1(102.94,32.02) ; 189.09,61.97 188.59,61.47 188.59,54.47 v1(190.59,52.47) ; 169.63,34.6 167.63,34.6 167.13,34.1 v1(162.13,34.1) 156.63,34.1 v1(156.49,34.25) ; 169.63,34.6 v1(169.63,40.6) ; v1(136.17,34.75) 119.67,34.75 v1(119.17,34.25)
RINSER: length 103.3
  Top Layer w0.5: v1(189.06,63.06) 191.56,63.06 R71.2
  Bottom Layer w0.5: U5.49 136.67,48.17 138.56,50.06 141.06,50.06 155.06,64.06 188.06,64.06 v1(189.06,63.06)
SAUCE1: length 151.4
  Top Layer w0.5: v1(132.17,14.53) 132.67,15.03 140.17,15.03 144.67,19.53 v1(144.67,23.53) ; v1(144.67,34.03) 144.67,31.03 v1(143.17,29.53) ; v1(121.17,14.53) 122.67,13.03 v1(123.67,13.03) ; R37.2 156.67,47.03 v1(150.67,41.03)
  Bottom Layer w0.5: v1(143.17,29.53) 143.17,24.53 144.17,23.53 v1(144.67,23.53) ; v1(144.67,34.03) 150.67,40.03 v1(150.67,41.03) ; U5.10 39.6,11.11 42.25,11.11 48.25,5.11 89.25,5.11 90.25,6.11 97.25,6.11 101.75,10.61 105.75,10.61 109.67,14.53 v1(121.17,14.53) ; v1(132.17,14.53) 125.17,14.53 v1(123.67,13.03)
SAUCE2: length 140.2
  Top Layer w0.5: v1(90.69,13.11) 92.19,13.11 96.19,9.11 102.19,9.11 v1(106.19,5.11) ; v1(128.19,10.61) 129.19,11.61 v1(131.69,11.61) ; v1(144.3,24.72) 143.8,24.22 143.8,19.72 140.3,16.22 v1(137.8,16.22) ; v1(153.8,30.72) 155.8,32.72 R39.2 ; v1(86.19,14.11) v1(77.69,14.11)
  Bottom Layer w0.5: v1(137.8,16.22) 136.3,16.22 v1(131.69,11.61) ; v1(77.69,14.11) 37.06,14.11 U5.11 ; v1(106.19,5.11) 116.69,5.11 118.69,7.11 124.69,7.11 v1(128.19,10.61) ; v1(153.8,30.72) 150.3,30.72 v1(144.3,24.72) ; v1(86.19,14.11) 89.69,14.11 v1(90.69,13.11)
SAUCE3: length 153.6
  Top Layer w0.5: v1(158.17,11.66) 158.17,17.16 R45.2 ; v1(108.17,4.16) v1(105.17,7.16) ; v1(91.67,12.16) 92.17,12.16 97.17,7.16 v1(102.67,7.16) ; v1(86.17,15.16) v1(76.67,15.16)
  Bottom Layer w0.5: v1(158.17,11.66) 162.67,7.16 162.67,5.16 160.17,2.66 136.17,2.66 133.67,5.16 117.67,5.16 116.67,4.16 v1(108.17,4.16) ; v1(105.17,7.16) v1(102.67,7.16) ; v1(91.67,12.16) 91.67,13.16 89.67,15.16 v1(86.17,15.16) ; U5.12 35.57,15.16 v1(76.67,15.16)
SAUCE4: length 72.9
  Top Layer w0.5: R47.2 155.67,1.84 112.9,1.84 102.17,12.56 v1(102.17,20.19)
  Bottom Layer w0.5: v1(102.17,20.19) 100.54,20.19 U5.25
SAUCE5: length 107.8
  Top Layer w0.5: v1(103.97,24.15) 103.97,28.15 108.47,32.65 v1(108.47,33.65) ; v1(146.36,41.15) 146.86,40.65 v1(148.86,40.65) ; v1(126.36,38.15) 126.36,36.65 v1(126.86,36.15) ; v1(170.86,43.15) 174.86,47.15 R53.2
  Bottom Layer w0.5: v1(146.36,41.15) 144.36,43.15 134.36,43.15 132.36,41.15 125.86,41.15 125.36,40.65 125.36,39.15 v1(126.36,38.15) ; v1(126.86,36.15) 110.97,36.15 v1(108.47,33.65) ; U5.27 101.97,24.15 v1(103.97,24.15) ; v1(170.86,43.15) 164.36,43.15 155.36,34.15 153.86,34.15 151.86,36.15 151.86,41.15 150.86,42.15 150.36,42.15 v1(148.86,40.65)
SAUCE6: length 89.2
  Top Layer w0.5: R55.2 174.49,32.72 v1(169.49,27.72) ; v1(100.54,28.77) v1(100.54,24.27)
  Bottom Layer w0.5: v1(100.54,28.77) 101.04,28.27 110.04,28.27 112.54,25.77 118.54,25.77 121.54,22.77 145.54,22.77 146.49,23.72 158.99,23.72 162.99,27.72 v1(169.49,27.72) ; v1(100.54,24.27) 99.54,24.27 U5.29
SAUCE7: length 81.9
  Top Layer w0.5: R57.2 173.49,18.16 v1(172.99,18.66)
  Bottom Layer w0.5: U5.31 111.84,25.31 112.34,24.81 115.34,24.81 118.41,21.73 159.26,21.73 161.07,23.54 168.1,23.54 v1(172.99,18.66)
SAUCE8: length 93.5
  Top Layer w0.5: v1(116.86,10.71) 113.18,10.71 102.18,21.71 v1(102.18,26.21) ; v1(161.86,5.71) 164.86,2.71 174.86,2.71 R59.2
  Bottom Layer w0.5: U5.33 99.68,26.21 v1(102.18,26.21) ; v1(161.86,5.71) 159.86,3.71 137.86,3.71 129.36,12.21 121.86,12.21 120.36,10.71 v1(116.86,10.71)
SAUCE9: length 105.7
  Top Layer w0.5: v1(183.56,42.7) 185.56,42.7 193.06,50.2 R65.2 ; U5.35 100.06,32.4 v1(100.06,33.7)
  Bottom Layer w0.5: v1(183.56,42.7) 182.06,44.2 151.06,44.2 144.06,37.2 110.56,37.2 107.06,33.7 v1(100.06,33.7)
SAUCE10: length 98.8
  Top Layer w0.5: v1(183.18,33.27) 191.18,33.27 R67.2
  Bottom Layer w0.5: v1(183.18,33.27) 139.01,33.27 136.58,35.7 128.62,35.7 128.35,35.43 111.85,35.43 109.35,32.93 U5.37
SAUCE11: length 103.5
  Top Layer w0.5: v1(190.68,22.2) 191.68,21.2 R73.2 ; v1(104.42,34.47) 106.42,32.47 v1(106.42,31.97)
  Bottom Layer w0.5: v1(190.68,22.2) 180.42,32.47 138.42,32.47 136.92,33.97 119.92,33.97 117.92,31.97 v1(106.42,31.97) ; v1(104.42,34.47) 99.04,34.47 U5.39
SAUCE12: length 123.2
  Top Layer w0.5: R75.2 183.86,1.13 112.42,1.13 101.42,12.13 101.42,31.63 101.92,32.13 v1(101.92,36.63)
  Bottom Layer w0.5: v1(101.92,36.63) 99.42,36.63 U5.41
SAUCE13: length 47.2
  Top Layer w0.5: U5.43 99.74,42.24 99.74,51.75 102.24,54.25 104.24,54.25 v1(105.74,55.75) ; v1(115.74,58.25) 116.24,58.75 122.24,58.75 R61.2
  Bottom Layer w0.5: v1(115.74,58.25) 108.24,58.25 v1(105.74,55.75)
SAUCE14: length 75
  Top Layer w0.5: v1(157.67,60.76) 157.17,61.26 R63.2 ; v1(130.67,46.26) 130.67,45.76 v1(129.17,44.26)
  Bottom Layer w0.5: v1(130.67,46.26) 153.67,46.26 158.17,50.76 158.17,60.26 v1(157.67,60.76) ; v1(129.17,44.26) 128.01,43.09 U5.45
SAUCE15: length 84.6
  Top Layer w0.5: v1(171.99,59.88) 173.49,59.88 R69.2
  Bottom Layer w0.5: v1(171.99,59.88) 157.24,45.13 98.54,45.13 U5.47
SCL: length 99.4
  Top Layer w0.5: U5.21 87.88,53.79 94.41,60.31 94.41,62.81 v1(92.91,64.31) 85.97,64.31 R12.2
  Bottom Layer w0.5: CN4.2 76.28,83.58 88.91,83.58 90.41,82.08 ; v1(92.91,64.31) 92.41,64.81 92.41,80.08 90.41,82.08 ; CN2.2 90.41,82.08
SDA: length 94.4
  Top Layer w0.5: R11.2 91.35,65.54 v1(90.45,65.54)
  Bottom Layer w0.5: 86.28,80.71 91.45,75.54 91.45,66.54 v1(90.45,65.54) 94.45,61.54 94.45,60.04 90.45,56.04 90.45,51.54 85.34,46.44 U5.20 ; 86.28,80.71 87.78,82.21 88.28,82.21 CN2.3 ; 86.28,80.71 73.91,80.71 CN4.3
SPEED: length 63.3
  Top Layer w0.5: v1(97.17,70.7) 97.67,71.2 R6.2 ; v1(103.04,53.32) 101.04,51.32 101.04,32.32 99.54,30.82 99.54,16.65 U5.23
  Bottom Layer w0.5: v1(103.04,53.32) 102.58,53.79 102.58,65.29 v1(97.17,70.7)
$1N1435: length 31.3
  Top Layer w0.5: v1(57.87,71.39) 51.87,71.39 50.37,69.89 U1.2 50.37,67.09 49.44,66.16 43.94,66.16 D2.1 ; v1(63.37,71.39) 69,71.39 L1.1
  Bottom Layer w0.5: v1(57.87,71.39) v1(63.37,71.39)
$1N1895: length 1.9
  Top Layer w0.5: LED3.2 R8.2
$1N2489: length 98.1
  Top Layer w0.5: U9.3 U9.2 14.64,70.93 ; R21.2 16.64,71.43 16.14,70.93 14.64,70.93 ; v1(74.41,15.93) U5.17 ; 14.64,70.93 13.64,70.93 13.14,70.43 13.14,69.43 13.64,68.93 v1(18.14,68.93) 18.95,68.93 R22.2
  Bottom Layer w0.5: v1(18.14,68.93) 71.14,15.93 v1(74.41,15.93)
$1N2492: length 18.5
  Top Layer w0.5: U9.6 8.72,71.81 v1(8.22,71.81) ; R19.2 v1(7.22,70.31)
  Bottom Layer w0.5: v1(7.22,70.31) 8.22,71.31 v1(8.22,71.81) 8.22,72.56 U8.1
$1N2493: length 14.8
  Top Layer w0.5: R17.2 7.46,71.2 ; 7.46,71.2 7.59,71.06 U9.7 ; 7.46,71.2 v1(7.46,71.7)
  Bottom Layer w0.5: U8.2 7.46,76.79 v1(7.46,71.7)
$1N2495: length 94
  Top Layer w0.5: 18.64,73.69 v1(19.64,72.69) ; 18.64,73.69 R20.2 ; 18.64,73.69 14.69,73.69 U9.4
  Bottom Layer w0.5: v1(19.64,72.69) 19.64,68.69 71.64,16.69 76.19,16.69 U5.18
$1N2496: length 94.8
  Top Layer w0.5: v1(27.91,65.43) 27.91,60.43 58.41,29.93 v1(60.91,29.93) ; U9.1 22.55,69.79 R23.2 25.91,67.43 v1(26.41,66.93)
  Bottom Layer w0.5: v1(26.41,66.93) v1(27.91,65.43) ; v1(60.91,29.93) 73.41,17.43 77.98,17.43 U5.19
